# EAGLE design BluetoothMate (EAGLE 6.5.0)
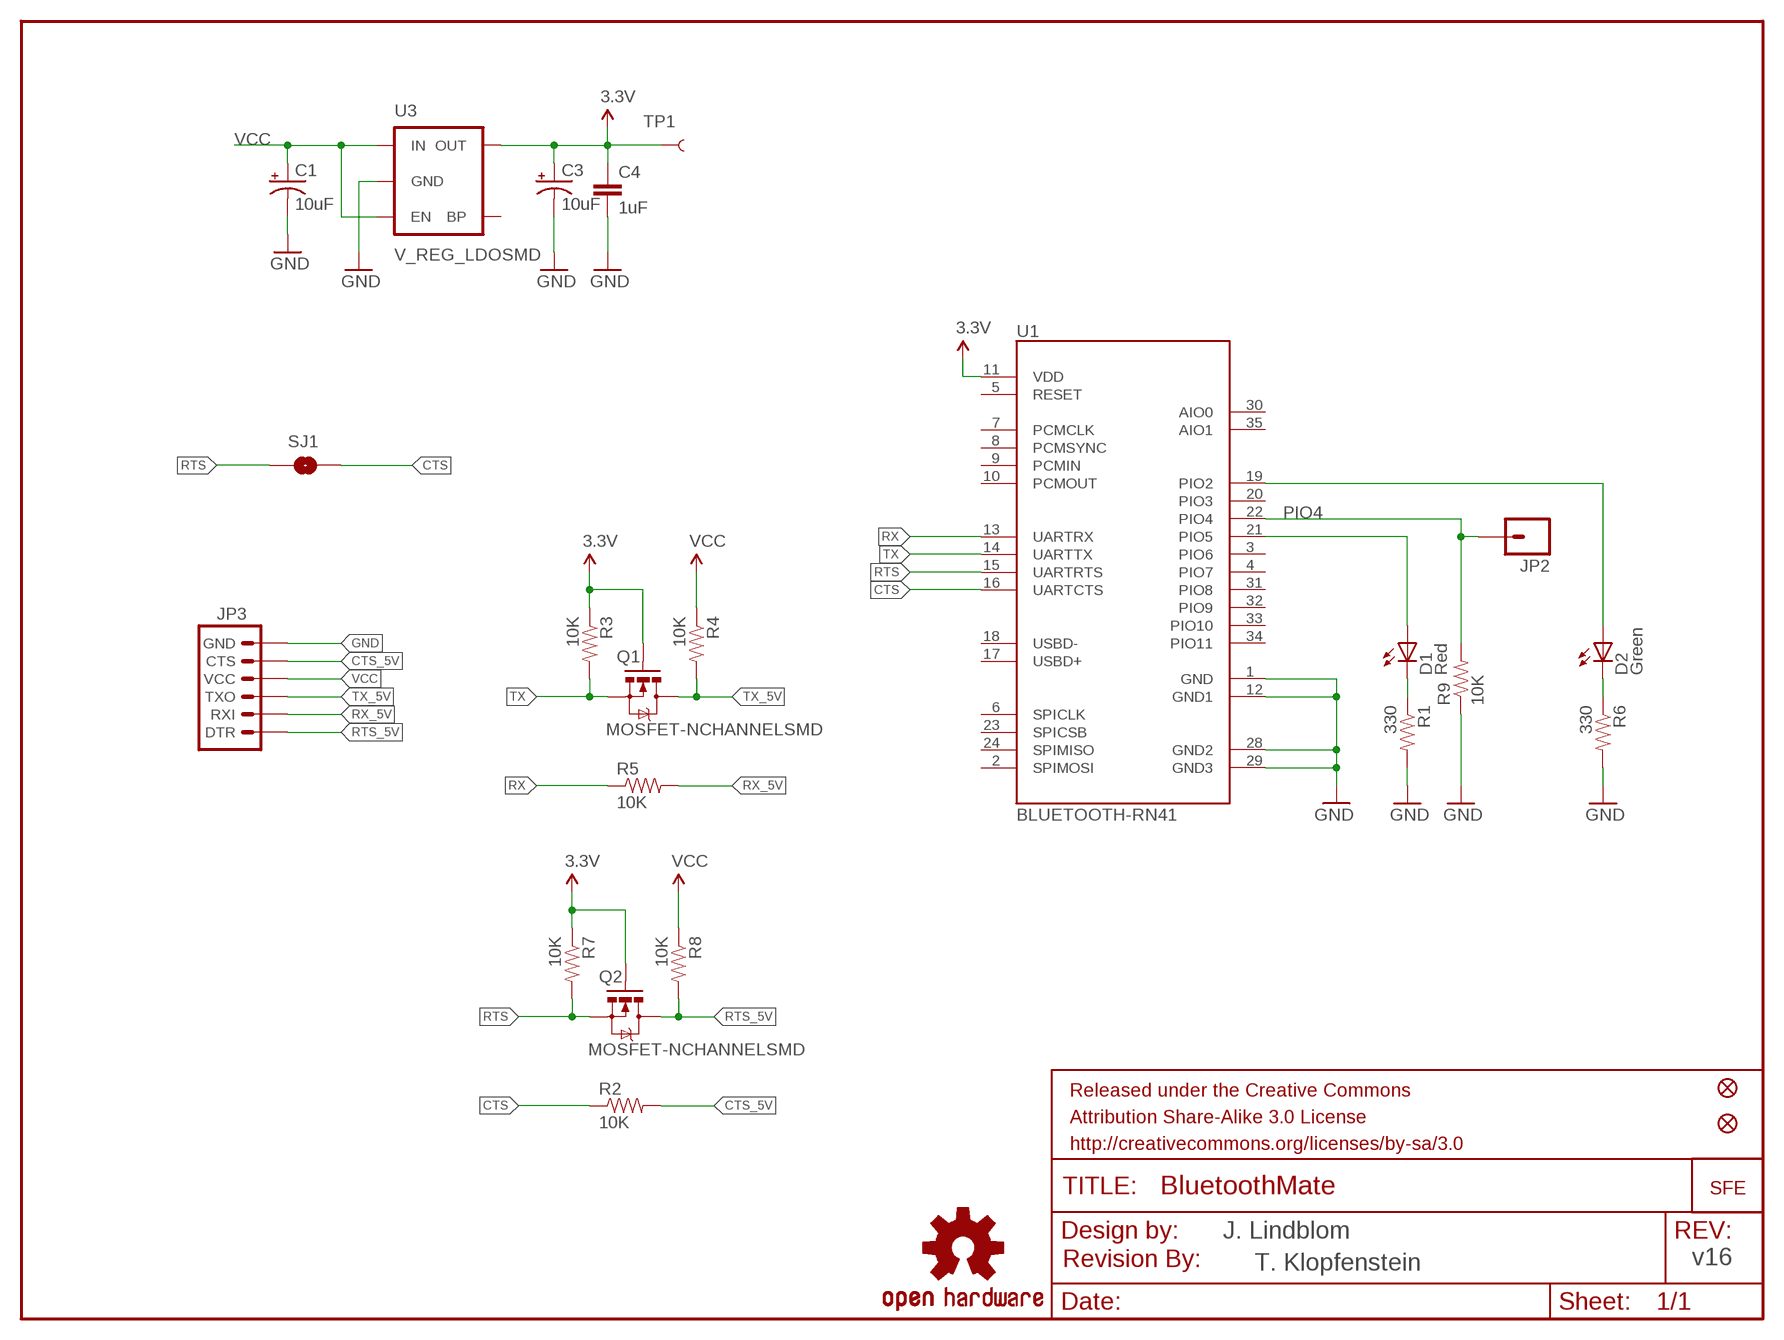
[diagram p0: schematic, sheet 1]

## Parts
C1  10uF  CAP_POL1206  [EIA3216]
C3  10uF  CAP_POL1206  [EIA3216]
C4  1uF  CAP0603-CAP  [0603-CAP]
D1  Red  LED0603  [LED-0603]
D2  Green  LED0603  [LED-0603]
FRAME1  FRAME-LETTER  [CREATIVE_COMMONS]
JP1  FIDUCIAL1X2.5  [FIDUCIAL-1X2.5]
JP2  M01SMDNS  [1X01NS]
JP3  ARDUINO_SERIAL_PROGRAMPTH  [1X06]
JP4  FIDUCIAL1X2.5  [FIDUCIAL-1X2.5]
LOGO1  OSHW-LOGOS  [OSHW-LOGO-S]
Q1  MOSFET-NCHANNELSMD  [SOT23-3]
Q2  MOSFET-NCHANNELSMD  [SOT23-3]
R1  330  RESISTOR0603-RES  [0603-RES]
R2  10K  RESISTOR0603-RES  [0603-RES]
R3  10K  RESISTOR0603-RES  [0603-RES]
R4  10K  RESISTOR0603-RES  [0603-RES]
R5  10K  RESISTOR0603-RES  [0603-RES]
R6  330  RESISTOR0603-RES  [0603-RES]
R7  10K  RESISTOR0603-RES  [0603-RES]
R8  10K  RESISTOR0603-RES  [0603-RES]
R9  10K  RESISTOR0603-RES  [0603-RES]
SJ1  SOLDERJUMPERNO  [SJ_2S-NO]
TP1  TEST-POINT3X5  [PAD.03X.05]
U1  BLUETOOTH-RN41  BLUETOOTH-RN41"  [RN41]
U3  V_REG_LDOSMD  [SOT23-5]
U$1  LOGO-SFENEW  [SFE-NEW-WEBLOGO]
U$2  REVISION  [REVISION]

## Nets
3.3V: C3.A(+) C4.1 Q1.1(G) Q2.1(G) R3.1 R7.1 TP1.P$1 U1.11(VDD) U3.5(OUT)
CTS: R2.1 SJ1.2 U1.16(UARTCTS)
CTS_5V: JP3.5(CTS) R2.2
D1: D1.C R1.1
D2: D2.C R6.1
GND: C1.C(-) C3.C(-) C4.2 JP3.6(GND) R1.2 R6.2 R9.1 U1.1(GND) U1.12(GND1) U1.28(GND2) U1.29(GND3) U3.2(GND)
N$1: D1.A U1.21(PIO5)
N$2: D2.A U1.19(PIO2)
PIO4: JP2.1 R9.2 U1.22(PIO4)
RTS: Q2.2(S) R7.2 SJ1.1 U1.15(UARTRTS)
RTS_5V: JP3.1(DTR) Q2.3(D) R8.2
RX: R5.1 U1.13(UARTRX)
RX_5V: JP3.2(RXI) R5.2
TX: Q1.2(S) R3.2 U1.14(UARTTX)
TX_5V: JP3.3(TXO) Q1.3(D) R4.2
VCC: C1.A(+) JP3.4(VCC) R4.1 R8.1 U3.1(IN) U3.3(EN)
Unconnected: U1.2(SPIMOSI) U1.3(PIO6) U1.4(PIO7) U1.5(RESET) U1.6(SPICLK) U1.7(PCMCLK) U1.8(PCMSYNC) U1.9(PCMIN) U1.10(PCMOUT) U1.17(USBD+) U1.18(USBD-) U1.20(PIO3) U1.23(SPICSB) U1.24(SPIMISO) U1.30(AIO0) U1.31(PIO8) U1.32(PIO9) U1.33(PIO10) U1.34(PIO11) U1.35(AIO1) U3.4(BP)

## Notes on the sheet
- J. Lindblom
- T. Klopfenstein | v16

## Library data of the parts
C1 C3 = SparkFun:CAP_POL: Capacitor Polarized These are standard SMD and PTH capacitors. Normally 10uF, 47uF, and 100uF in electrolytic and tantalum varieties. Always verify the external diameter of the through hole cap, it varies with capacity, voltage, and manufacturer. The EIA devices should be standard.
C4 = SparkFun:CAP: Capacitor Standard 0603 ceramic capacitor, and 0.1" leaded capacitor.
D1 D2 = SparkFun:LED: LEDs Standard schematic elements and footprints for 5mm, 3mm, 1206, and 0603 sized LEDs. 5mm - Spark Fun Electronics SKU : COM-00529 (and others)
FRAME1 = SparkFun-Aesthetics:FRAME-LETTER: Schematic Frame Standard 8.5x11 US Letter frame
JP1 JP4 = abes:FIDUCIAL: Fiducial Alignment Points Various fiducial points for machine vision alignment.
JP2 = SparkFun:M01: Header 1 Standard 1-pin 0.1" header. Use with straight break away headers (SKU : PRT-00116), right angle break away headers (PRT-00553), swiss pins (PRT-00743), machine pins (PRT-00117), and female headers (PRT-00115).
JP3 = SparkFun:ARDUINO_SERIAL_PROGRAM
LOGO1 = SparkFun-Aesthetics:OSHW-LOGO: Open Source Hardware Logo This logo indicates the piece of hardware it is found on incorporates a OSHW license and/or adheres to the definition of open source hardware found here: http://freedomdefined.org/OSHW
Q1 Q2 = SparkFun:MOSFET-NCHANNEL
R1-R9 = SparkFun:RESISTOR: Resistor Basic schematic elements and footprints for 0603, 1206, and PTH 1/10th watt (small) resistors.
SJ1 = SparkFun:SOLDERJUMPER: Solder Jumper Standard SMD solder jumper. Used to automate production. Two varients : Normally Open and Normally Closed are the same, but have different paste layers. NC will have a large amount of paste and should jumper during reflow.
TP1 = SparkFun:TEST-POINT
U1 = SparkFun-RF:BLUETOOTH-RN41: Bluetooth SMD module
U3 = SparkFun:V_REG_LDO: Voltage Regulator LDO Standard 150mA LDO voltage regulator in SOT-23 layout. Micrel part MIC5205. BP (by-pass) pin is used to lower output noise with 470pF cap.
U$1 = SparkFun:LOGO-SFE: Spark Fun Electronics PCB Logo This is the standard Spark Fun Electronics PCB logo.
U$2 = SparkFun-Aesthetics:REVISION

## Board
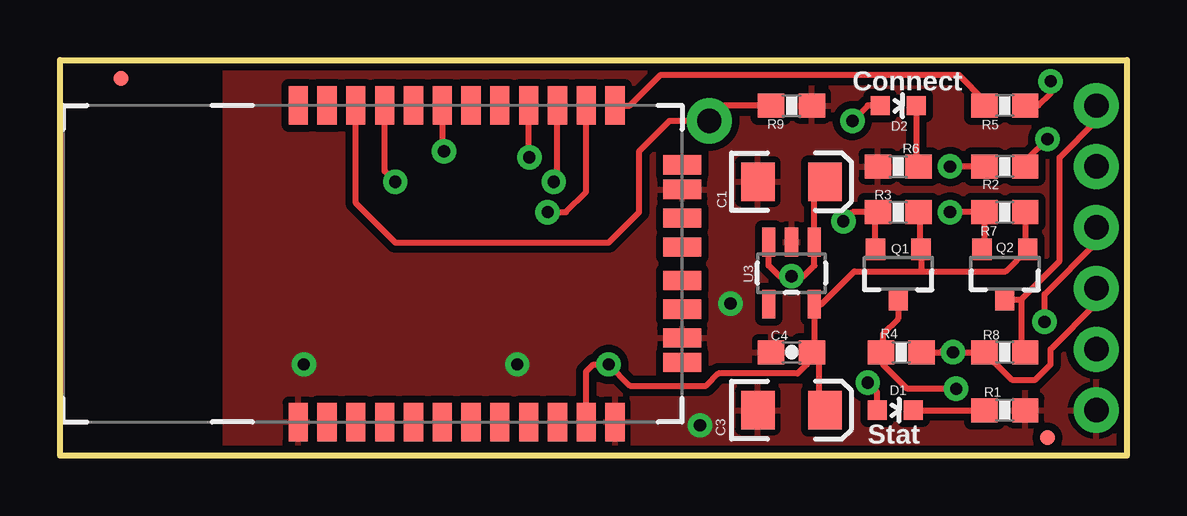
[diagram p1: board, top side]
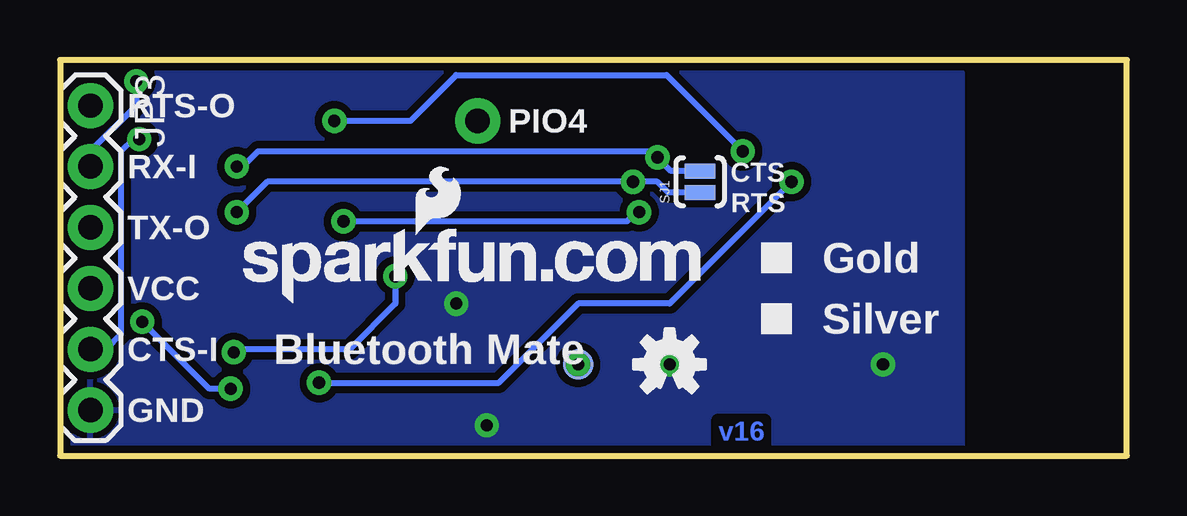
[diagram p2: board, bottom side, seen from below]

Size 44.45 x 16.51 mm. Coordinates in mm from the lower left corner, seen from the top.
Outline: 0,0 0,16.51 44.45,16.51 44.45,0 0,0
Copper layers (1*16): Top 0.035mm / dielectric 1.5mm / Bottom 0.035mm
Design rules "SparkFun *": minimum track width 8mil, minimum drill 20mil, track to track 8mil, track to pad 8mil, pad to pad 8mil, via to via 8mil, smd to smd 8mil, copper to edge 9mil, drill to drill 8mil, minimum pad ring 12mil, minimum via ring 10mil, stop-mask expansion 4mil, vias tented up to drill 20mil, thermal gap 10mil

### Footprints (pad centres in the part's own frame; a part is rotated, then mirrored left to right if it is on the bottom)
EIA3216 = smd 1.4 x 1.6: A 1.4,0; C -1.4,0
0603-CAP = smd 1.1 x 1: 1 -0.85,0; 2 0.85,0
LED-0603 = smd 0.8 x 0.8: A 0,-0.75; C 0,0.75
FIDUCIAL-1X2.5 = smd 0.635 x 0.635: 1 0,0
1X01NS = drill 1.016 pad 1.88: 1 0,0
1X06 = drill 1.016 pad 1.88: 1 0,0; 2 2.54,0; 3 5.08,0; 4 7.62,0; 5 10.16,0; 6 12.7,0
SOT23-3 = smd 0.8 x 0.9: 1 -0.95,-1; 2 0.95,-1; 3 0,1.1
0603-RES = smd 1.1 x 1: 1 -0.85,0; 2 0.85,0
SJ_2S-NO = smd 0.635 x 1.27: 1 -0.45,0; 2 0.45,0
PAD.03X.05 = smd 1.27 x 1.27: P$1 0,0
RN41 = smd 0.8 x 1.6: 1 -6.6,-6.6; 2 -5.4,-6.6; 3 -4.2,-6.6; 4 -3,-6.6; 5 -1.8,-6.6; 6 -0.6,-6.6; 7 0.6,-6.6; 8 1.8,-6.6; 9 3,-6.6; 10 4.2,-6.6; 11 5.4,-6.6; 12 6.6,-6.6; 13 6.6,6.6; 14 5.4,6.6; 15 4.2,6.6; 16 3,6.6; 17 1.8,6.6; 18 0.6,6.6; 19 -0.6,6.6; 20 -1.8,6.6; 21 -3,6.6; 22 -4.2,6.6; 23 -5.4,6.6; 24 -6.6,6.6 | smd 1.6 x 0.8: 28 9.4,3.1; 29 9.4,-3.1; 30 9.4,4.122; 31 9.4,1.9; 32 9.4,0.7; 33 9.4,-0.7; 34 9.4,-1.9; 35 9.4,-4.122
SOT23-5 = smd 0.55 x 1.2: 1 -0.95,-1.3; 2 0,-1.3; 3 0.95,-1.3; 4 0.95,1.3; 5 -0.95,1.3

### Placement (x,y rotation side)
C1  30.48,11.43 0 top
C3  30.48,1.91 0 top
C4  30.48,4.32 180 top
D1  34.8,1.91 270 top
D2  34.92,14.61 270 top
FRAME1  -2.01,-10.16 0 top  (outside the outline)
JP1  2.54,15.75 0 top
JP2  27.05,13.97 0 top
JP3  43.18,14.61 270 bottom
JP4  41.15,0.76 0 top
LOGO1  19.05,3.81 0 bottom
Q1  34.92,7.62 180 top
Q2  39.37,7.62 180 top
R1  39.37,1.91 0 top
R2  39.37,12.06 0 top
R3  34.92,10.16 180 top
R4  35.05,4.32 180 top
R5  39.37,14.61 0 top
R6  34.92,12.06 180 top
R7  39.37,10.16 180 top
R8  39.37,4.32 0 top
R9  30.48,14.61 180 top
SJ1  17.78,11.43 90 bottom
TP1  22.86,3.81 0 bottom
U1  16.53,8.01 0 top
U3  30.48,7.62 180 top
U$1  36.83,6.35 0 bottom
U$2  9.53,-12.83 0 top  (outside the outline)

### Tracks (layer width: path | path; a pad name or v marks a point on that pad's centre or on a via)
3.3V  (via drill 0.51)
  Top 0.254: 31.11,3.94 31.62,3.94 31.62,2.16 C3.A | U1.11 21.93,3.51 22.23,3.81 TP1.P$1 23.75,2.92 26.92,2.92 27.43,3.43 30.73,3.43 31.11,3.81 31.11,3.94 | 31.11,3.94 31.33,4.15 C4.1 31.43,4.42 U3.5 31.72,6.32 33.1,7.7 35.94,7.7 | R7.1 40.22,8.93 40.32,8.83 Q2.1 39.4,7.7 35.94,7.7 | 35.56,9.95 R3.1 35.85,10.09 35.85,8.62 Q1.1 35.88,7.76 35.94,7.7
  other vias: 22.86,3.81
CTS  (via drill 0.51)
  Top 0.254: U1.16 19.53,12.48 v19.56,12.45 | 38.52,12.41 R2.1 v37.08,12.06
  Bottom 0.254: SJ1.2 18.99,11.88 v19.56,12.45 19.81,12.7 36.2,12.7 37.08,11.81 v37.08,12.06
CTS_5V  (via drill 0.51)
  Top 0.254: R2.2 40.22,12.41 40.35,12.41 v41.15,13.21
  Bottom 0.254: JP3.5 42.55,4.45 41.91,5.08 41.91,12.7 41.4,13.21 v41.15,13.21 41.27,13.34
D1
  Top 0.254: D1.C R1.1 38.73,1.91
D2
  Top 0.254: D2.C 35.67,12.16 R6.1
GND  (via drill 0.51)
  Top 0.254: U1.12 23,1.41 22.86,1.27
  other vias: 27.94,6.35 26.67,1.27 10.16,3.81 19.05,3.81
  pour Bottom (isolate 0.305): 6.86,0 44.4,0 44.4,16 6.86,16
  pour Top (isolate 0.305): 6.86,0 44.4,0 44.4,16 6.86,16
N$1  (via drill 0.51)
  Top 0.254: U1.21 13.53,11.87 v13.97,11.43 | D1.A 34.05,2.65 v33.66,3.05
  Bottom 0.254: v13.97,11.43 19.05,6.35 22.86,6.35 26.16,3.05 v33.66,3.05
N$2  (via drill 0.51)
  Top 0.254: U1.19 15.93,12.78 v16,12.7 | D2.A 33.66,14.61 v33.02,13.97
  Bottom 0.254: v33.02,13.97 29.84,13.97 27.94,15.88 19.18,15.88 v16,12.7
PIO4
  Top 0.254: U1.22 12.33,10.53 13.97,8.89 22.86,8.89 24.13,10.16 24.13,12.7 25.4,13.97 JP2.1 27.69,14.61 R9.2
RTS  (via drill 0.51)
  Top 0.254: U1.15 20.73,11.58 v20.57,11.43 | Q2.2 38.52,8.72 R7.2 v37.08,10.16
  Bottom 0.254: SJ1.1 19.11,10.98 19.56,11.43 v20.57,11.43 35.81,11.43 v37.08,10.16
RTS_5V
  Top 0.254: JP3.1 43.18,13.97 41.66,12.45 41.66,8.13 40.05,6.52 | Q2.3 40.05,6.52 | 40.05,6.52 40.05,4.49 R8.2
RX
  Top 0.254: U1.13 23.75,14.61 25.02,15.88 37.47,15.88 38.52,14.82 R5.1
RX_5V  (via drill 0.51)
  Top 0.254: 40.22,14.82 R5.2 40.77,14.61 41.27,15.11 v41.27,15.62
  Bottom 0.254: JP3.2 43.18,12.7 41.27,14.61 v41.27,15.62
TX  (via drill 0.51)
  Top 0.254: U1.14 21.93,11 21.08,10.16 v20.32,10.16 | Q1.2 33.98,10.06 R3.2 33.02,10.16 v32.64,9.78
  Bottom 0.254: v20.32,10.16 20.45,10.16 20.83,9.78 v32.64,9.78
TX_5V  (via drill 0.51)
  Top 0.254: v41.02,5.59 41.02,6.73 43.18,8.89 JP3.3 | Q1.3 34.92,5.71 34.29,5.08 34.29,4.41 R4.2 34.29,4.23 34.29,3.81 35.31,2.79 v37.34,2.79
  Bottom 0.254: v37.34,2.79 38.23,2.79 v41.02,5.59
VCC  (via drill 0.51)
  Top 0.254: U3.3 29.53,7.93 29.97,7.49 v30.48,7.49 30.99,7.49 31.43,7.93 U3.1 31.43,10.98 C1.A | JP3.4 43.18,6.35 41.27,4.45 41.27,3.81 40.64,3.17 39.66,3.17 R8.1 v37.21,4.32 R4.1 36.7,4.32 36.83,4.45
  Bottom 0.254: v30.48,7.49 30.48,6.35 32.38,4.45 37.08,4.45 v37.21,4.32

### Text on the board
Bottom: v16
tPlace: Connect | Stat
bPlace: RTS-O | PIO4 | RX-I | CTS | RTS | TX-O | Gold | VCC | Silver | Bluetooth Mate | CTS-I | GND
Document: J. Lindblom | T. Klopfenstein